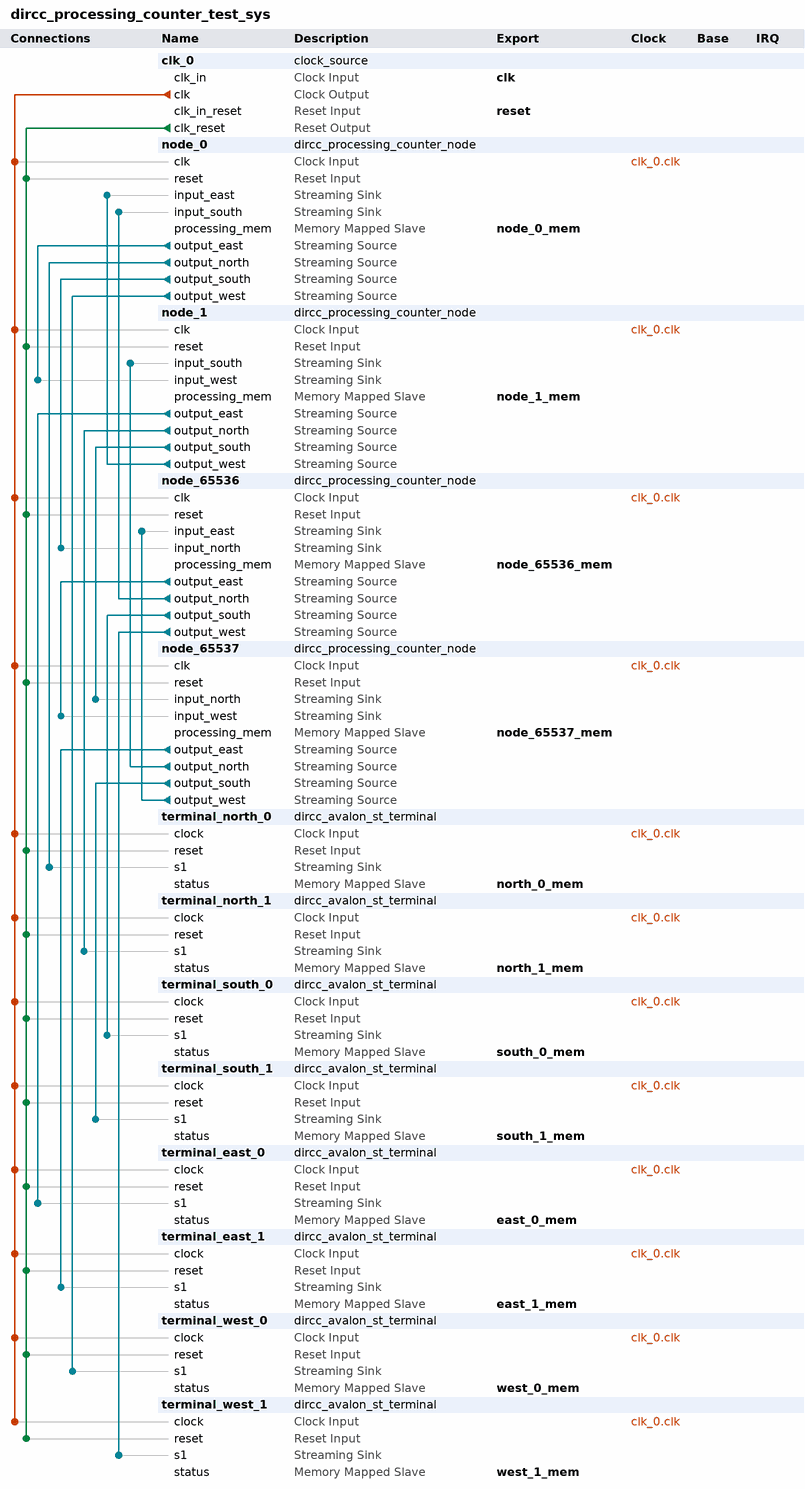
[diagram p0: system contents]
# Platform Designer (Qsys) system dircc_processing_counter_test_sys, Cyclone V 5CSEMA5F31C6
# Parameters at their usual value, and those the tool derives, are not listed.
package require -exact qsys 16.1
create_system dircc_processing_counter_test_sys
set_project_property DEVICE_FAMILY {Cyclone V}
set_project_property DEVICE 5CSEMA5F31C6

add_instance clk_0 clock_source 16.1
set_instance_parameter_value clk_0 clockFrequency 50000000

add_instance node_0 dircc_processing_counter_node 1.0
set_instance_parameter_value node_0 address 0

add_instance node_1 dircc_processing_counter_node 1.0
set_instance_parameter_value node_1 address 1

add_instance node_65536 dircc_processing_counter_node 1.0
set_instance_parameter_value node_65536 address 65536

add_instance node_65537 dircc_processing_counter_node 1.0
set_instance_parameter_value node_65537 address 65537

add_instance terminal_north_0 dircc_avalon_st_terminal 1.0
set_instance_parameter_value terminal_north_0 DATA_WIDTH 32

add_instance terminal_north_1 dircc_avalon_st_terminal 1.0
set_instance_parameter_value terminal_north_1 DATA_WIDTH 32

add_instance terminal_south_0 dircc_avalon_st_terminal 1.0
set_instance_parameter_value terminal_south_0 DATA_WIDTH 32

add_instance terminal_south_1 dircc_avalon_st_terminal 1.0
set_instance_parameter_value terminal_south_1 DATA_WIDTH 32

add_instance terminal_east_0 dircc_avalon_st_terminal 1.0
set_instance_parameter_value terminal_east_0 DATA_WIDTH 32

add_instance terminal_east_1 dircc_avalon_st_terminal 1.0
set_instance_parameter_value terminal_east_1 DATA_WIDTH 32

add_instance terminal_west_0 dircc_avalon_st_terminal 1.0
set_instance_parameter_value terminal_west_0 DATA_WIDTH 32

add_instance terminal_west_1 dircc_avalon_st_terminal 1.0
set_instance_parameter_value terminal_west_1 DATA_WIDTH 32

# connections
add_connection clk_0.clk node_0.clk clock
add_connection clk_0.clk node_1.clk clock
add_connection clk_0.clk node_65536.clk clock
add_connection clk_0.clk node_65537.clk clock
add_connection clk_0.clk terminal_east_0.clock clock
add_connection clk_0.clk terminal_east_1.clock clock
add_connection clk_0.clk terminal_north_0.clock clock
add_connection clk_0.clk terminal_north_1.clock clock
add_connection clk_0.clk terminal_south_0.clock clock
add_connection clk_0.clk terminal_south_1.clock clock
add_connection clk_0.clk terminal_west_0.clock clock
add_connection clk_0.clk terminal_west_1.clock clock
add_connection clk_0.clk_reset node_0.reset reset
add_connection clk_0.clk_reset node_1.reset reset
add_connection clk_0.clk_reset node_65536.reset reset
add_connection clk_0.clk_reset node_65537.reset reset
add_connection clk_0.clk_reset terminal_east_0.reset reset
add_connection clk_0.clk_reset terminal_east_1.reset reset
add_connection clk_0.clk_reset terminal_north_0.reset reset
add_connection clk_0.clk_reset terminal_north_1.reset reset
add_connection clk_0.clk_reset terminal_south_0.reset reset
add_connection clk_0.clk_reset terminal_south_1.reset reset
add_connection clk_0.clk_reset terminal_west_0.reset reset
add_connection clk_0.clk_reset terminal_west_1.reset reset
add_connection node_0.output_east node_1.input_west avalon_streaming
add_connection node_0.output_north terminal_north_0.s1 avalon_streaming
add_connection node_0.output_south node_65536.input_north avalon_streaming
add_connection node_0.output_west terminal_west_0.s1 avalon_streaming
add_connection node_1.output_east terminal_east_0.s1 avalon_streaming
add_connection node_1.output_north terminal_north_1.s1 avalon_streaming
add_connection node_1.output_south node_65537.input_north avalon_streaming
add_connection node_1.output_west node_0.input_east avalon_streaming
add_connection node_65536.output_east node_65537.input_west avalon_streaming
add_connection node_65536.output_north node_0.input_south avalon_streaming
add_connection node_65536.output_south terminal_south_0.s1 avalon_streaming
add_connection node_65536.output_west terminal_west_1.s1 avalon_streaming
add_connection node_65537.output_east terminal_east_1.s1 avalon_streaming
add_connection node_65537.output_north node_1.input_south avalon_streaming
add_connection node_65537.output_south terminal_south_1.s1 avalon_streaming
add_connection node_65537.output_west node_65536.input_east avalon_streaming

# exported interfaces
add_interface clk clock sink
set_interface_property clk EXPORT_OF clk_0.clk_in
add_interface east_0_mem avalon slave
set_interface_property east_0_mem EXPORT_OF terminal_east_0.status
add_interface east_1_mem avalon slave
set_interface_property east_1_mem EXPORT_OF terminal_east_1.status
add_interface node_0_mem avalon slave
set_interface_property node_0_mem EXPORT_OF node_0.processing_mem
add_interface node_1_mem avalon slave
set_interface_property node_1_mem EXPORT_OF node_1.processing_mem
add_interface node_65536_mem avalon slave
set_interface_property node_65536_mem EXPORT_OF node_65536.processing_mem
add_interface node_65537_mem avalon slave
set_interface_property node_65537_mem EXPORT_OF node_65537.processing_mem
add_interface north_0_mem avalon slave
set_interface_property north_0_mem EXPORT_OF terminal_north_0.status
add_interface north_1_mem avalon slave
set_interface_property north_1_mem EXPORT_OF terminal_north_1.status
add_interface reset reset sink
set_interface_property reset EXPORT_OF clk_0.clk_in_reset
add_interface south_0_mem avalon slave
set_interface_property south_0_mem EXPORT_OF terminal_south_0.status
add_interface south_1_mem avalon slave
set_interface_property south_1_mem EXPORT_OF terminal_south_1.status
add_interface west_0_mem avalon slave
set_interface_property west_0_mem EXPORT_OF terminal_west_0.status
add_interface west_1_mem avalon slave
set_interface_property west_1_mem EXPORT_OF terminal_west_1.status

set_interconnect_requirement {$system} qsys_mm.clockCrossingAdapter HANDSHAKE
set_interconnect_requirement {$system} qsys_mm.enableEccProtection FALSE
set_interconnect_requirement {$system} qsys_mm.insertDefaultSlave FALSE
set_interconnect_requirement {$system} qsys_mm.maxAdditionalLatency 1

save_system dircc_processing_counter_test_sys.qsys
